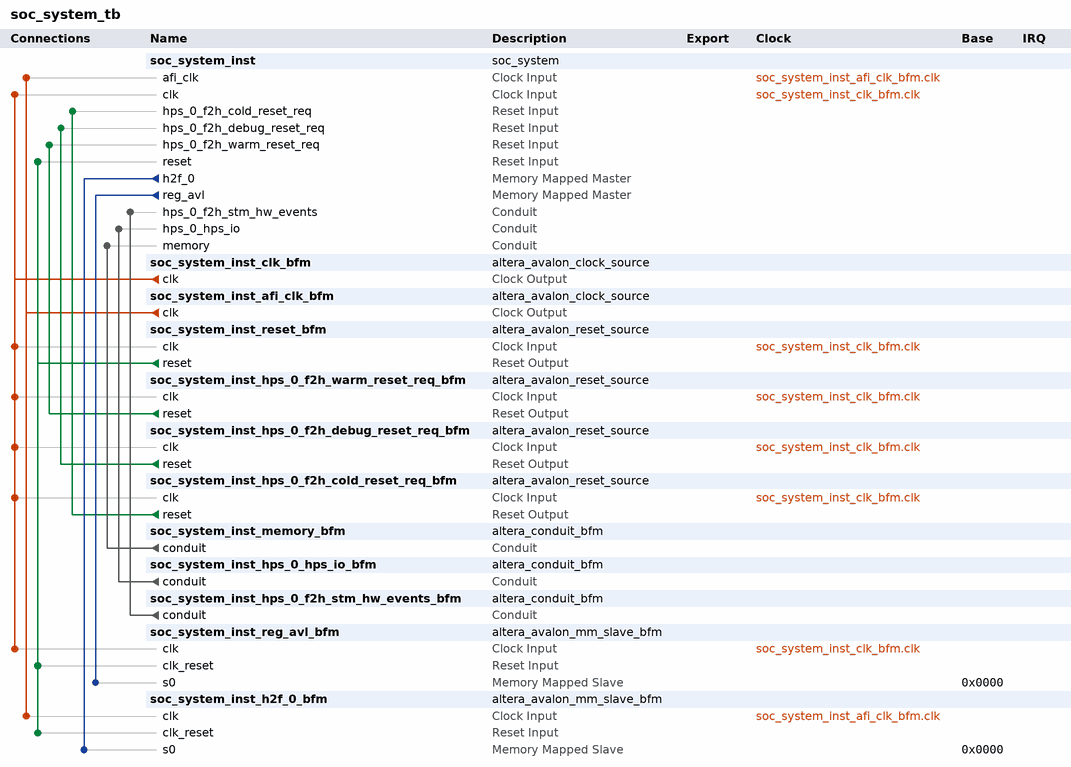
[diagram p0: system contents]
# Platform Designer (Qsys) system soc_system_tb, Cyclone V 5CSXFC6D6F31C6
# Parameters at their usual value, and those the tool derives, are not listed.
package require -exact qsys 13.1
create_system soc_system_tb
set_project_property DEVICE_FAMILY {Cyclone V}
set_project_property DEVICE 5CSXFC6D6F31C6

add_instance soc_system_inst soc_system 1.0

add_instance soc_system_inst_clk_bfm altera_avalon_clock_source 13.1

add_instance soc_system_inst_afi_clk_bfm altera_avalon_clock_source 13.1

add_instance soc_system_inst_reset_bfm altera_avalon_reset_source 13.1
set_instance_parameter_value soc_system_inst_reset_bfm ASSERT_HIGH_RESET 0
set_instance_parameter_value soc_system_inst_reset_bfm INITIAL_RESET_CYCLES 50

add_instance soc_system_inst_hps_0_f2h_warm_reset_req_bfm altera_avalon_reset_source 13.1
set_instance_parameter_value soc_system_inst_hps_0_f2h_warm_reset_req_bfm ASSERT_HIGH_RESET 0
set_instance_parameter_value soc_system_inst_hps_0_f2h_warm_reset_req_bfm INITIAL_RESET_CYCLES 50

add_instance soc_system_inst_hps_0_f2h_debug_reset_req_bfm altera_avalon_reset_source 13.1
set_instance_parameter_value soc_system_inst_hps_0_f2h_debug_reset_req_bfm ASSERT_HIGH_RESET 0
set_instance_parameter_value soc_system_inst_hps_0_f2h_debug_reset_req_bfm INITIAL_RESET_CYCLES 50

add_instance soc_system_inst_hps_0_f2h_cold_reset_req_bfm altera_avalon_reset_source 13.1
set_instance_parameter_value soc_system_inst_hps_0_f2h_cold_reset_req_bfm ASSERT_HIGH_RESET 0
set_instance_parameter_value soc_system_inst_hps_0_f2h_cold_reset_req_bfm INITIAL_RESET_CYCLES 50

add_instance soc_system_inst_memory_bfm altera_conduit_bfm 13.1
set_instance_parameter_value soc_system_inst_memory_bfm CLOCKED_SIGNAL false
set_instance_parameter_value soc_system_inst_memory_bfm ENABLE_RESET false
set_instance_parameter_value soc_system_inst_memory_bfm SIGNAL_ROLES mem_a,mem_ba,mem_ck,mem_ck_n,mem_cke,mem_cs_n,mem_ras_n,mem_cas_n,mem_we_n,mem_reset_n,mem_dq,mem_dqs,mem_dqs_n,mem_odt,mem_dm,oct_rzqin
set_instance_parameter_value soc_system_inst_memory_bfm SIGNAL_WIDTHS 15,3,1,1,1,1,1,1,1,1,32,4,4,1,4,1
set_instance_parameter_value soc_system_inst_memory_bfm SIGNAL_DIRECTIONS input,input,input,input,input,input,input,input,input,input,bidir,bidir,bidir,input,input,output

add_instance soc_system_inst_hps_0_hps_io_bfm altera_conduit_bfm 13.1
set_instance_parameter_value soc_system_inst_hps_0_hps_io_bfm CLOCKED_SIGNAL false
set_instance_parameter_value soc_system_inst_hps_0_hps_io_bfm ENABLE_RESET false
set_instance_parameter_value soc_system_inst_hps_0_hps_io_bfm SIGNAL_ROLES hps_io_emac1_inst_TX_CLK,hps_io_emac1_inst_TXD0,hps_io_emac1_inst_TXD1,hps_io_emac1_inst_TXD2,hps_io_emac1_inst_TXD3,hps_io_emac1_inst_RXD0,hps_io_emac1_inst_MDIO,hps_io_emac1_inst_MDC,hps_io_emac1_inst_RX_CTL,hps_io_emac1_inst_TX_CTL,hps_io_emac1_inst_RX_CLK,hps_io_emac1_inst_RXD1,hps_io_emac1_inst_RXD2,hps_io_emac1_inst_RXD3,hps_io_qspi_inst_IO0,hps_io_qspi_inst_IO1,hps_io_qspi_inst_IO2,hps_io_qspi_inst_IO3,hps_io_qspi_inst_SS0,hps_io_qspi_inst_CLK,hps_io_sdio_inst_CMD,hps_io_sdio_inst_D0,hps_io_sdio_inst_D1,hps_io_sdio_inst_CLK,hps_io_sdio_inst_D2,hps_io_sdio_inst_D3,hps_io_usb1_inst_D0,hps_io_usb1_inst_D1,hps_io_usb1_inst_D2,hps_io_usb1_inst_D3,hps_io_usb1_inst_D4,hps_io_usb1_inst_D5,hps_io_usb1_inst_D6,hps_io_usb1_inst_D7,hps_io_usb1_inst_CLK,hps_io_usb1_inst_STP,hps_io_usb1_inst_DIR,hps_io_usb1_inst_NXT,hps_io_spim0_inst_CLK,hps_io_spim0_inst_MOSI,hps_io_spim0_inst_MISO,hps_io_spim0_inst_SS0,hps_io_spim1_inst_CLK,hps_io_spim1_inst_MOSI,hps_io_spim1_inst_MISO,hps_io_spim1_inst_SS0,hps_io_uart0_inst_RX,hps_io_uart0_inst_TX,hps_io_i2c1_inst_SDA,hps_io_i2c1_inst_SCL,hps_io_gpio_inst_GPIO00,hps_io_gpio_inst_GPIO09,hps_io_gpio_inst_GPIO35,hps_io_gpio_inst_GPIO40,hps_io_gpio_inst_GPIO48,hps_io_gpio_inst_GPIO53,hps_io_gpio_inst_GPIO54,hps_io_gpio_inst_GPIO55,hps_io_gpio_inst_GPIO56,hps_io_gpio_inst_GPIO61,hps_io_gpio_inst_GPIO62
set_instance_parameter_value soc_system_inst_hps_0_hps_io_bfm SIGNAL_WIDTHS 1,1,1,1,1,1,1,1,1,1,1,1,1,1,1,1,1,1,1,1,1,1,1,1,1,1,1,1,1,1,1,1,1,1,1,1,1,1,1,1,1,1,1,1,1,1,1,1,1,1,1,1,1,1,1,1,1,1,1,1,1
set_instance_parameter_value soc_system_inst_hps_0_hps_io_bfm SIGNAL_DIRECTIONS input,input,input,input,input,output,bidir,input,output,input,output,output,output,output,bidir,bidir,bidir,bidir,input,input,bidir,bidir,bidir,input,bidir,bidir,bidir,bidir,bidir,bidir,bidir,bidir,bidir,bidir,output,input,output,output,input,input,output,input,input,input,output,input,output,input,bidir,bidir,bidir,bidir,bidir,bidir,bidir,bidir,bidir,bidir,bidir,bidir,bidir

add_instance soc_system_inst_hps_0_f2h_stm_hw_events_bfm altera_conduit_bfm 13.1
set_instance_parameter_value soc_system_inst_hps_0_f2h_stm_hw_events_bfm CLOCKED_SIGNAL false
set_instance_parameter_value soc_system_inst_hps_0_f2h_stm_hw_events_bfm ENABLE_RESET false
set_instance_parameter_value soc_system_inst_hps_0_f2h_stm_hw_events_bfm SIGNAL_ROLES stm_hwevents
set_instance_parameter_value soc_system_inst_hps_0_f2h_stm_hw_events_bfm SIGNAL_WIDTHS 28
set_instance_parameter_value soc_system_inst_hps_0_f2h_stm_hw_events_bfm SIGNAL_DIRECTIONS output

add_instance soc_system_inst_reg_avl_bfm altera_avalon_mm_slave_bfm 13.1
set_instance_parameter_value soc_system_inst_reg_avl_bfm AV_ADDRESS_W 10
set_instance_parameter_value soc_system_inst_reg_avl_bfm AV_SYMBOL_W 8
set_instance_parameter_value soc_system_inst_reg_avl_bfm AV_NUMSYMBOLS 4
set_instance_parameter_value soc_system_inst_reg_avl_bfm AV_BURSTCOUNT_W 1
set_instance_parameter_value soc_system_inst_reg_avl_bfm AV_READRESPONSE_W 1
set_instance_parameter_value soc_system_inst_reg_avl_bfm AV_WRITERESPONSE_W 1
set_instance_parameter_value soc_system_inst_reg_avl_bfm USE_READ 1
set_instance_parameter_value soc_system_inst_reg_avl_bfm USE_WRITE 1
set_instance_parameter_value soc_system_inst_reg_avl_bfm USE_ADDRESS 1
set_instance_parameter_value soc_system_inst_reg_avl_bfm USE_BYTE_ENABLE 1
set_instance_parameter_value soc_system_inst_reg_avl_bfm USE_BURSTCOUNT 1
set_instance_parameter_value soc_system_inst_reg_avl_bfm USE_READ_DATA 1
set_instance_parameter_value soc_system_inst_reg_avl_bfm USE_READ_DATA_VALID 1
set_instance_parameter_value soc_system_inst_reg_avl_bfm USE_WRITE_DATA 1
set_instance_parameter_value soc_system_inst_reg_avl_bfm USE_BEGIN_TRANSFER 0
set_instance_parameter_value soc_system_inst_reg_avl_bfm USE_BEGIN_BURST_TRANSFER 0
set_instance_parameter_value soc_system_inst_reg_avl_bfm USE_ARBITERLOCK 0
set_instance_parameter_value soc_system_inst_reg_avl_bfm USE_LOCK 0
set_instance_parameter_value soc_system_inst_reg_avl_bfm USE_DEBUGACCESS 1
set_instance_parameter_value soc_system_inst_reg_avl_bfm USE_WAIT_REQUEST 1
set_instance_parameter_value soc_system_inst_reg_avl_bfm USE_TRANSACTIONID 0
set_instance_parameter_value soc_system_inst_reg_avl_bfm USE_WRITERESPONSE 0
set_instance_parameter_value soc_system_inst_reg_avl_bfm USE_READRESPONSE 0
set_instance_parameter_value soc_system_inst_reg_avl_bfm USE_CLKEN 0
set_instance_parameter_value soc_system_inst_reg_avl_bfm ASSERT_HIGH_RESET 1
set_instance_parameter_value soc_system_inst_reg_avl_bfm ASSERT_HIGH_WAITREQUEST 1
set_instance_parameter_value soc_system_inst_reg_avl_bfm ASSERT_HIGH_READ 1
set_instance_parameter_value soc_system_inst_reg_avl_bfm ASSERT_HIGH_WRITE 1
set_instance_parameter_value soc_system_inst_reg_avl_bfm ASSERT_HIGH_BYTEENABLE 1
set_instance_parameter_value soc_system_inst_reg_avl_bfm ASSERT_HIGH_READDATAVALID 1
set_instance_parameter_value soc_system_inst_reg_avl_bfm ASSERT_HIGH_ARBITERLOCK 1
set_instance_parameter_value soc_system_inst_reg_avl_bfm ASSERT_HIGH_LOCK 1
set_instance_parameter_value soc_system_inst_reg_avl_bfm AV_BURST_LINEWRAP 0
set_instance_parameter_value soc_system_inst_reg_avl_bfm AV_BURST_BNDR_ONLY 0
set_instance_parameter_value soc_system_inst_reg_avl_bfm AV_MAX_PENDING_READS 64
set_instance_parameter_value soc_system_inst_reg_avl_bfm AV_MAX_PENDING_WRITES 0
set_instance_parameter_value soc_system_inst_reg_avl_bfm AV_FIX_READ_LATENCY 0
set_instance_parameter_value soc_system_inst_reg_avl_bfm AV_READ_WAIT_TIME 1
set_instance_parameter_value soc_system_inst_reg_avl_bfm AV_WRITE_WAIT_TIME 0
set_instance_parameter_value soc_system_inst_reg_avl_bfm REGISTER_WAITREQUEST 0
set_instance_parameter_value soc_system_inst_reg_avl_bfm AV_REGISTERINCOMINGSIGNALS 0
set_instance_parameter_value soc_system_inst_reg_avl_bfm ADDRESS_UNITS WORDS
set_instance_parameter_value soc_system_inst_reg_avl_bfm VHDL_ID 0

add_instance soc_system_inst_h2f_0_bfm altera_avalon_mm_slave_bfm 13.1
set_instance_parameter_value soc_system_inst_h2f_0_bfm AV_ADDRESS_W 26
set_instance_parameter_value soc_system_inst_h2f_0_bfm AV_SYMBOL_W 8
set_instance_parameter_value soc_system_inst_h2f_0_bfm AV_NUMSYMBOLS 16
set_instance_parameter_value soc_system_inst_h2f_0_bfm AV_BURSTCOUNT_W 6
set_instance_parameter_value soc_system_inst_h2f_0_bfm AV_READRESPONSE_W 1
set_instance_parameter_value soc_system_inst_h2f_0_bfm AV_WRITERESPONSE_W 1
set_instance_parameter_value soc_system_inst_h2f_0_bfm USE_READ 1
set_instance_parameter_value soc_system_inst_h2f_0_bfm USE_WRITE 1
set_instance_parameter_value soc_system_inst_h2f_0_bfm USE_ADDRESS 1
set_instance_parameter_value soc_system_inst_h2f_0_bfm USE_BYTE_ENABLE 1
set_instance_parameter_value soc_system_inst_h2f_0_bfm USE_BURSTCOUNT 1
set_instance_parameter_value soc_system_inst_h2f_0_bfm USE_READ_DATA 1
set_instance_parameter_value soc_system_inst_h2f_0_bfm USE_READ_DATA_VALID 1
set_instance_parameter_value soc_system_inst_h2f_0_bfm USE_WRITE_DATA 1
set_instance_parameter_value soc_system_inst_h2f_0_bfm USE_BEGIN_TRANSFER 0
set_instance_parameter_value soc_system_inst_h2f_0_bfm USE_BEGIN_BURST_TRANSFER 0
set_instance_parameter_value soc_system_inst_h2f_0_bfm USE_ARBITERLOCK 0
set_instance_parameter_value soc_system_inst_h2f_0_bfm USE_LOCK 0
set_instance_parameter_value soc_system_inst_h2f_0_bfm USE_DEBUGACCESS 1
set_instance_parameter_value soc_system_inst_h2f_0_bfm USE_WAIT_REQUEST 1
set_instance_parameter_value soc_system_inst_h2f_0_bfm USE_TRANSACTIONID 0
set_instance_parameter_value soc_system_inst_h2f_0_bfm USE_WRITERESPONSE 0
set_instance_parameter_value soc_system_inst_h2f_0_bfm USE_READRESPONSE 0
set_instance_parameter_value soc_system_inst_h2f_0_bfm USE_CLKEN 0
set_instance_parameter_value soc_system_inst_h2f_0_bfm ASSERT_HIGH_RESET 1
set_instance_parameter_value soc_system_inst_h2f_0_bfm ASSERT_HIGH_WAITREQUEST 1
set_instance_parameter_value soc_system_inst_h2f_0_bfm ASSERT_HIGH_READ 1
set_instance_parameter_value soc_system_inst_h2f_0_bfm ASSERT_HIGH_WRITE 1
set_instance_parameter_value soc_system_inst_h2f_0_bfm ASSERT_HIGH_BYTEENABLE 1
set_instance_parameter_value soc_system_inst_h2f_0_bfm ASSERT_HIGH_READDATAVALID 1
set_instance_parameter_value soc_system_inst_h2f_0_bfm ASSERT_HIGH_ARBITERLOCK 1
set_instance_parameter_value soc_system_inst_h2f_0_bfm ASSERT_HIGH_LOCK 1
set_instance_parameter_value soc_system_inst_h2f_0_bfm AV_BURST_LINEWRAP 0
set_instance_parameter_value soc_system_inst_h2f_0_bfm AV_BURST_BNDR_ONLY 0
set_instance_parameter_value soc_system_inst_h2f_0_bfm AV_MAX_PENDING_READS 64
set_instance_parameter_value soc_system_inst_h2f_0_bfm AV_MAX_PENDING_WRITES 0
set_instance_parameter_value soc_system_inst_h2f_0_bfm AV_FIX_READ_LATENCY 0
set_instance_parameter_value soc_system_inst_h2f_0_bfm AV_READ_WAIT_TIME 1
set_instance_parameter_value soc_system_inst_h2f_0_bfm AV_WRITE_WAIT_TIME 0
set_instance_parameter_value soc_system_inst_h2f_0_bfm REGISTER_WAITREQUEST 0
set_instance_parameter_value soc_system_inst_h2f_0_bfm AV_REGISTERINCOMINGSIGNALS 0
set_instance_parameter_value soc_system_inst_h2f_0_bfm ADDRESS_UNITS WORDS
set_instance_parameter_value soc_system_inst_h2f_0_bfm VHDL_ID 1

# connections
add_connection soc_system_inst_afi_clk_bfm.clk soc_system_inst.afi_clk clock
add_connection soc_system_inst_afi_clk_bfm.clk soc_system_inst_h2f_0_bfm.clk clock
add_connection soc_system_inst_clk_bfm.clk soc_system_inst.clk clock
add_connection soc_system_inst_clk_bfm.clk soc_system_inst_hps_0_f2h_cold_reset_req_bfm.clk clock
add_connection soc_system_inst_clk_bfm.clk soc_system_inst_hps_0_f2h_debug_reset_req_bfm.clk clock
add_connection soc_system_inst_clk_bfm.clk soc_system_inst_hps_0_f2h_warm_reset_req_bfm.clk clock
add_connection soc_system_inst_clk_bfm.clk soc_system_inst_reg_avl_bfm.clk clock
add_connection soc_system_inst_clk_bfm.clk soc_system_inst_reset_bfm.clk clock
add_connection soc_system_inst_hps_0_f2h_cold_reset_req_bfm.reset soc_system_inst.hps_0_f2h_cold_reset_req reset
add_connection soc_system_inst_hps_0_f2h_debug_reset_req_bfm.reset soc_system_inst.hps_0_f2h_debug_reset_req reset
add_connection soc_system_inst_hps_0_f2h_warm_reset_req_bfm.reset soc_system_inst.hps_0_f2h_warm_reset_req reset
add_connection soc_system_inst_reset_bfm.reset soc_system_inst.reset reset
add_connection soc_system_inst_reset_bfm.reset soc_system_inst_h2f_0_bfm.clk_reset reset
add_connection soc_system_inst_reset_bfm.reset soc_system_inst_reg_avl_bfm.clk_reset reset
add_connection soc_system_inst.h2f_0 soc_system_inst_h2f_0_bfm.s0 avalon
set_connection_parameter_value soc_system_inst.h2f_0/soc_system_inst_h2f_0_bfm.s0 baseAddress 0x0000
add_connection soc_system_inst.reg_avl soc_system_inst_reg_avl_bfm.s0 avalon
set_connection_parameter_value soc_system_inst.reg_avl/soc_system_inst_reg_avl_bfm.s0 baseAddress 0x0000
add_connection soc_system_inst_hps_0_f2h_stm_hw_events_bfm.conduit soc_system_inst.hps_0_f2h_stm_hw_events conduit
add_connection soc_system_inst_hps_0_hps_io_bfm.conduit soc_system_inst.hps_0_hps_io conduit
add_connection soc_system_inst_memory_bfm.conduit soc_system_inst.memory conduit

set_interconnect_requirement {$system} qsys_mm.clockCrossingAdapter HANDSHAKE
set_interconnect_requirement {$system} qsys_mm.maxAdditionalLatency 1
set_interconnect_requirement {$system} qsys_mm.insertDefaultSlave false

save_system soc_system_tb.qsys
